# EasyEDA schematic SCH_SemaforkyNG v2.0_2023-06-26.json
TITLE: Sheet_1; REV: 1.0; Date: 2023-02-12; Sheet: 1/1; Drawn By: vaclav.krajicek; Company: Your Company
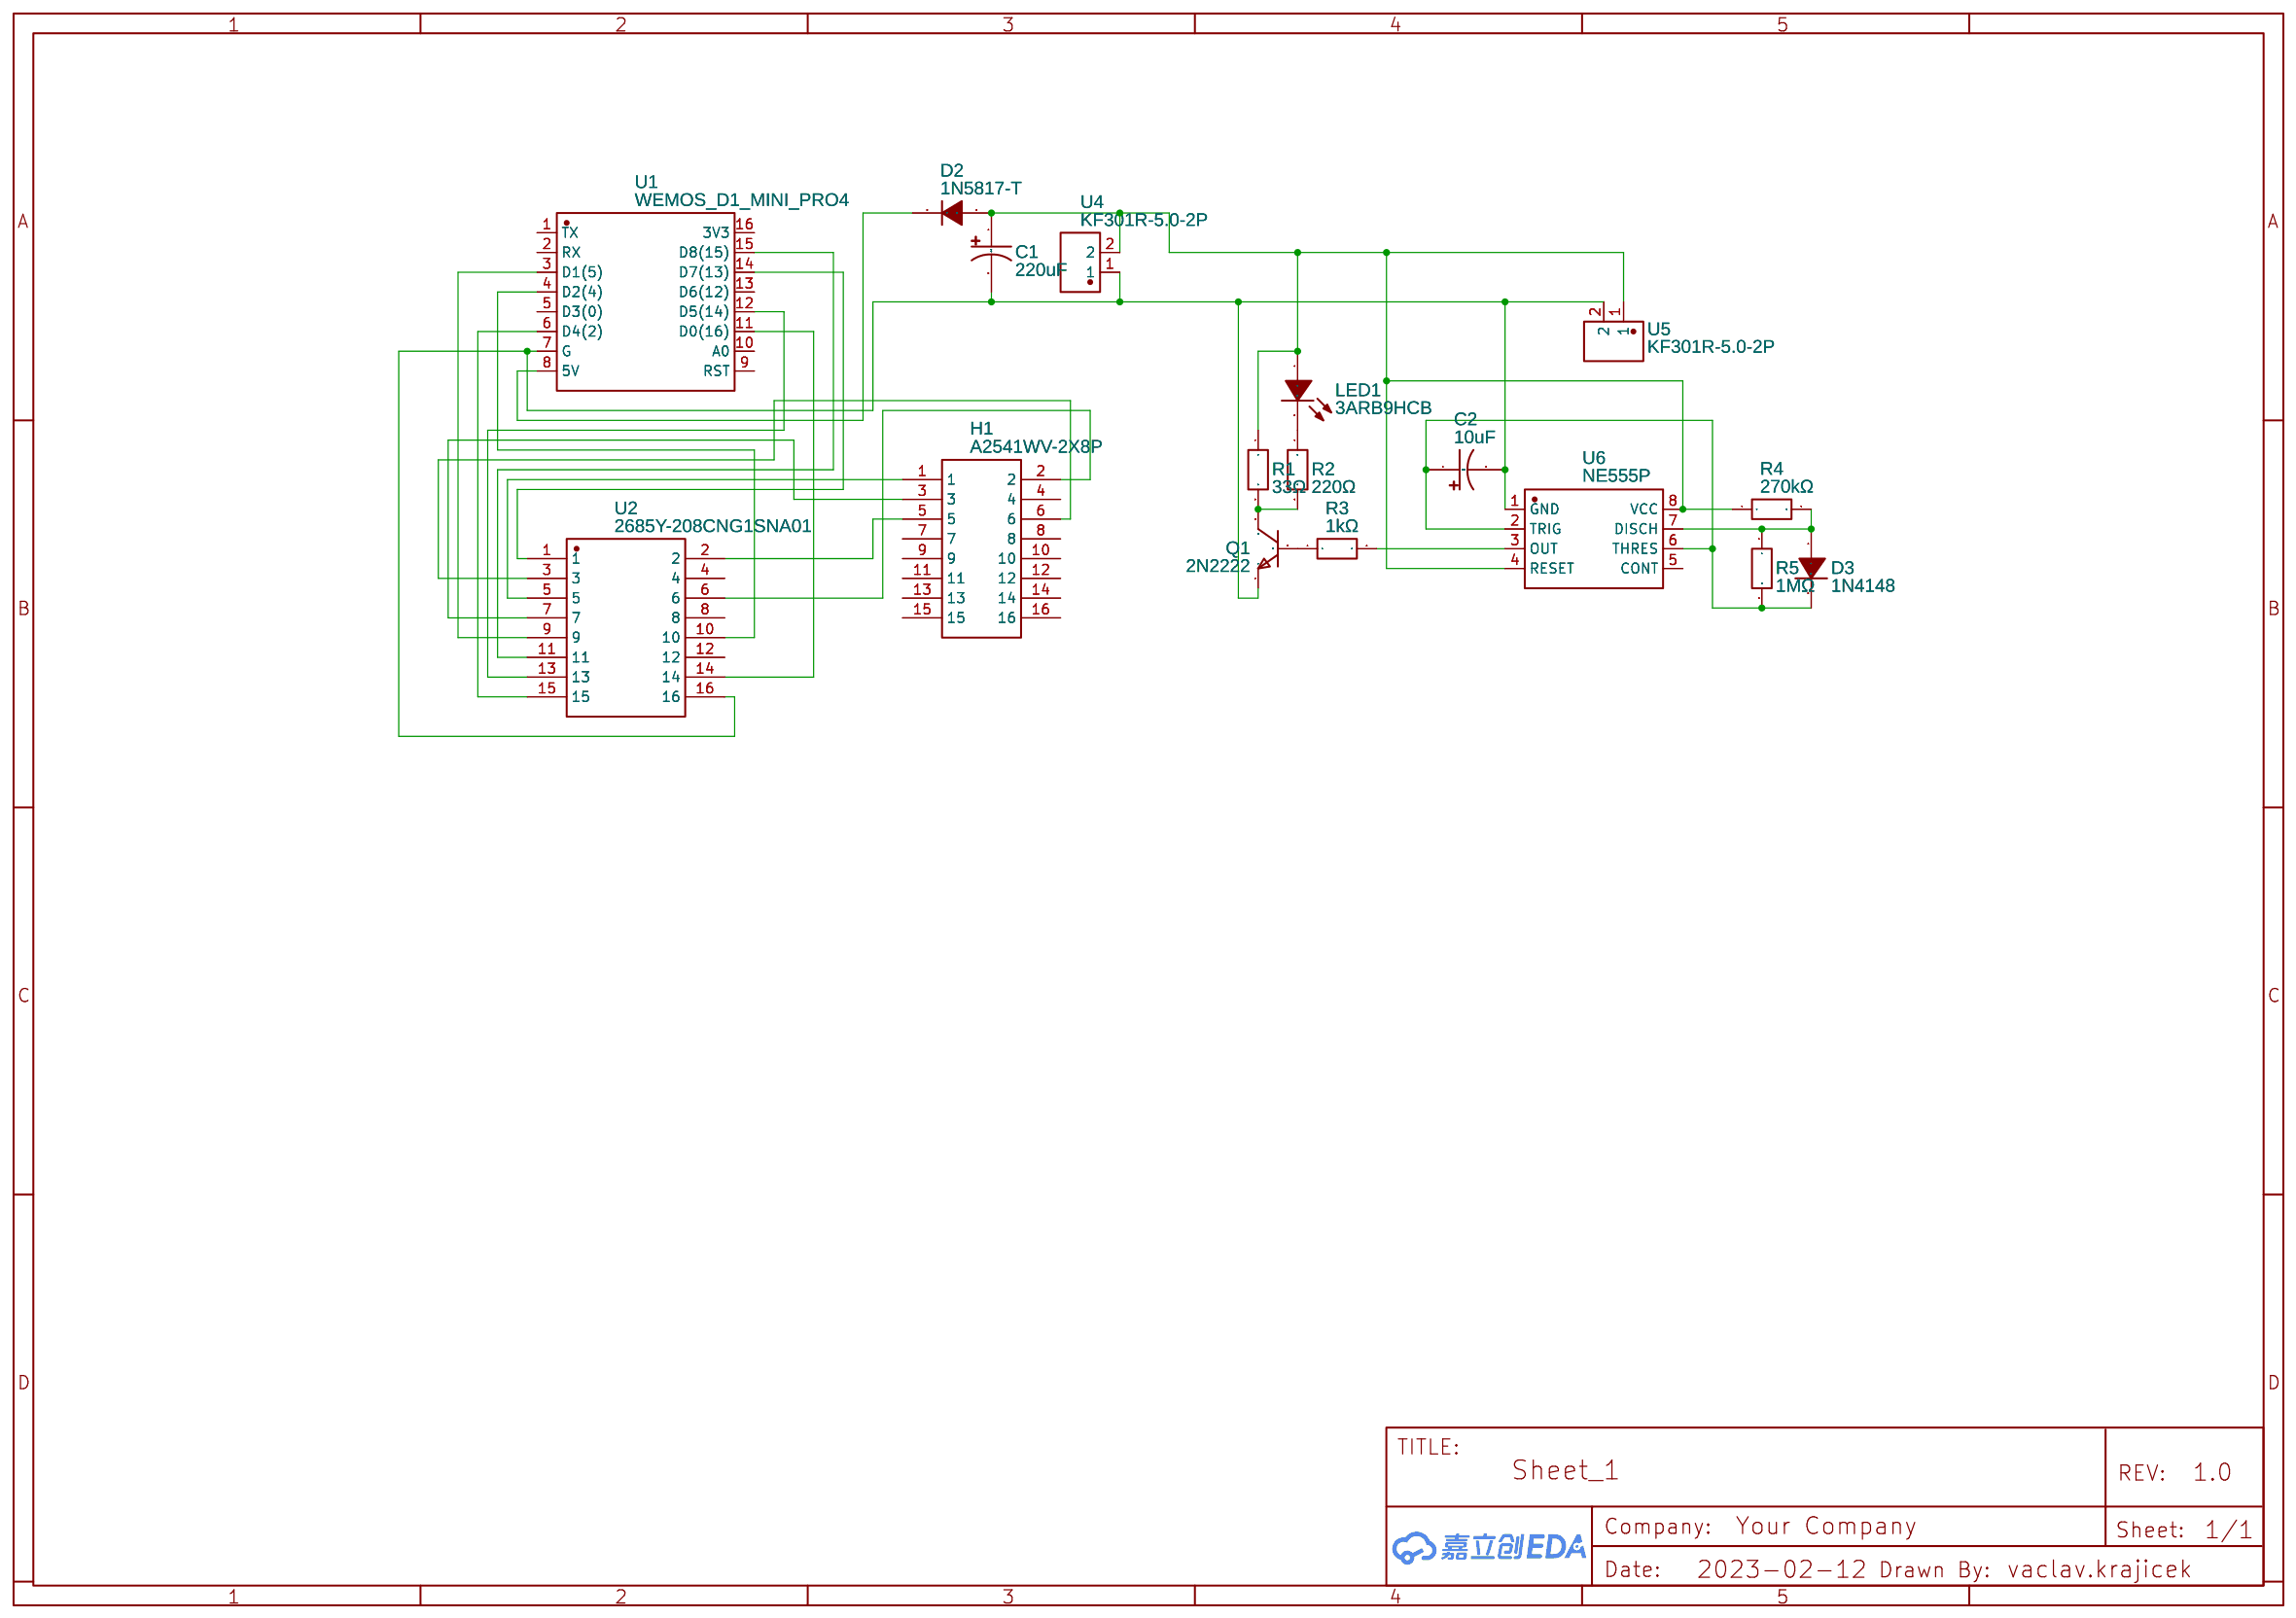
[diagram p0: schematic sheet]

## Parts
C1  220uF  [CAP-TH_BD6.3-P2.50-D1.0-FD]
C2  10uF  [CAP-TH_BD6.3-P2.50-D1.0-FD]
D2  1N5817-T  [DO-41_BD2.4-L4.7-P8.70-D0.9-FD]
D3  1N4148  [DO-35_BD2.0-L4.0-P8.00-D0.5-FD]
H1  A2541WV-2X8P  [HDR-TH_16P-P2.54-V-M-R2-C8-S2.54-1]
LED1  3ARB9HCB  [LED-3MM]
Q1  2N2222  [TO-92-3_L4.9-W3.7-P1.27-L]
R1  33Ω  [RES-TH_BD2.7-L6.2-P10.20-D0.4]
R2  220Ω  [RES-TH_BD2.7-L6.2-P10.20-D0.4]
R3  1kΩ  [RES-TH_BD2.7-L6.2-P10.20-D0.4]
R4  270kΩ  [RES-TH_BD2.7-L6.2-P10.20-D0.4]
R5  1MΩ  [RES-TH_BD2.7-L6.2-P10.20-D0.4]
U1  WEMOS_D1_MINI_PRO4  [DIP-16_WEMOS_D1_MINI_PRO4]
U2  2685Y-208CNG1SNA01  [HDR-TH_16P-P2.54-V-F-R2-C8-S2.54]
U4  KF301R-5.0-2P  [CONN-TH_P5.00_KF301R-5.0-2P]
U5  KF301R-5.0-2P  [CONN-TH_P5.00_KF301R-5.0-2P]
U6  NE555P  [DIP-8_L9.8-W6.6-P2.54-LS7.6-BL]

## Library data of the parts
C1 C2 = RC025M221LO6.3*12TH-2A1E: Supplier: LCSC; Supplier Part: C357621; Manufacturer: BERYL(绿宝石); Contributor: LCSC; JLCPCB Part Class: Extended Part
D2 = 1N5817-T: Supplier: LCSC; Supplier Part: C507852; Manufacturer: DIODES(美台); Contributor: LCSC; JLCPCB Part Class: Extended Part
D3 = 1N4148: Supplier: LCSC; Manufacturer: ST(先科); Supplier Part: C14516; JLCPCB Part Class: Extended Part
H1 = A2541WV-2X8P: Supplier: LCSC; Supplier Part: C225523; Manufacturer: CJT(长江连接器); Manufacturer Part: A2541WV-2x8P; Contributor: LCSC; JLCPCB Part Class: Extended Part
LED1 = 3ARB9HCB: Supplier: LCSC; Manufacturer: KENTO; Supplier Part: C42016
Q1 = 2N2222: Supplier: LCSC; Manufacturer: ST(先科); Manufacturer Part: 2N2222A; Contributor: LCSC; Supplier Part: C118536; JLCPCB Part Class: Extended Part
R1-R5 = CR1/4W-2K2±5%-ST26: Supplier: LCSC; Supplier Part: C2894623; Manufacturer: VO(翔胜); link: https://atta.szlcsc.com/upload/public/pdf/source/20210803/C2857407_45FF53FE186CAB545115AD37303966CD.pdf; Contributor: lcsc; JLCPCB Part Class: Extended Part
U1 = WEMOS_D1_MINI_PRO4: Supplier: LCSC; Supplier Part: C2837266; Manufacturer: null; Manufacturer Part: Wemos_D1_mini_Pro4; Contributor: LCSC; JLCPCB Part Class: Extended Part
U2 = 2685Y-208CNG1SNA01: Supplier: LCSC; Supplier Part: C350292; Manufacturer: 华宇创; Contributor: LCSC; JLCPCB Part Class: Extended Part
U4 U5 = KF301R-5.0-2P: Supplier: LCSC; Supplier Part: C474883; Manufacturer: KEFA(科发); Contributor: LCSC; JLCPCB Part Class: Extended Part
U6 = NE555P: Supplier: LCSC; Manufacturer: TI(德州仪器); Supplier Part: C46749; JLCPCB Part Class: Extended Part; Frequency: 100kHz

## Nets
Net-(C1-1): C1.1 D2.1(A) LED1.1(A) R1.1 R4.1 U4.2 U5.1 U6.4(RESET) U6.8(VCC)
Net-(C1-2): C1.2 C2.2 Q1.1(E) U1.7(G) U2.16 U4.1 U5.2 U6.1(GND)
Net-(C2-1): C2.1 D3.2(C) R5.2 U6.2(TRIG) U6.6(THRES)
Net-(D2-2): D2.2(K) U1.8(5V)
Net-(D3-1): D3.1(A) R4.2 R5.1 U6.7(DISCH)
Net-(H1-1): H1.1 U2.5
Net-(H1-2): H1.2 U2.6
Net-(H1-3): H1.3 U2.7
Net-(H1-5): H1.5 U2.2
Net-(H1-6): H1.6 U2.3
Net-(LED1-2): LED1.2(K) R2.1
Net-(Q1-2): Q1.2(B) R3.1
Net-(Q1-3): Q1.3(C) R1.2 R2.2
Net-(R3-2): R3.2 U6.3(OUT)
Net-(U1-3): U1.3(D1(5)) U2.9
Net-(U1-4): U1.4(D2(4)) U2.10
Net-(U1-6): U1.6(D4(2)) U2.15
Net-(U1-11): U1.11(D0(16)) U2.14
Net-(U1-12): U1.12(D5(14)) U2.13
Net-(U1-14): U1.14(D7(13)) U2.1
Net-(U1-15): U1.15(D8(15)) U2.11

Not connected (* = marked no-connect by the designer): H1 4 7 8 9 10 11 12 13 14 15 16; U1 1(TX) 2(RX) 5(D3(0)) 9(RST) 10(A0) 13(D6(12)) 16(3V3); U2 4 8 12; U6 5(CONT)
